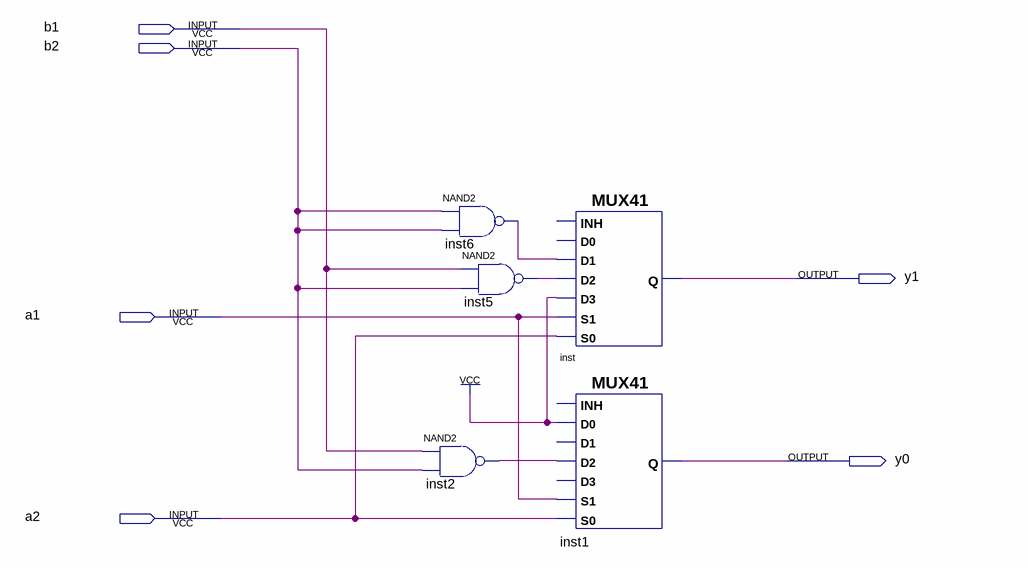
[diagram p0: schematic sheet]
// Quartus schematic proj1.bdf as structural Verilog: 5 symbols, 6 pins
module proj1 (
  input  b1,
  input  b2,
  input  a1,
  input  a2,
  output y1,
  output y0
);

  wire inst2_out, inst5_out, inst6_out;

  nand inst2 (inst2_out, b1, b2);
  nand inst6 (inst6_out, b2, b2);
  nand inst5 (inst5_out, b1, b2);
  MUX41 inst (.S0(a2), .D2(inst5_out), .S1(a1), .D3(1'b1), .D1(inst6_out), .Q(y1));  // open: D0, INH
  MUX41 inst1 (.S0(a2), .D2(inst2_out), .S1(a1), .D0(1'b1), .Q(y0));  // open: D3, INH, D1
endmodule
